# Altium schematic sheet Altimiter_SCH.SchDoc
size A; SheetNumber: 5; SheetTotal: 9
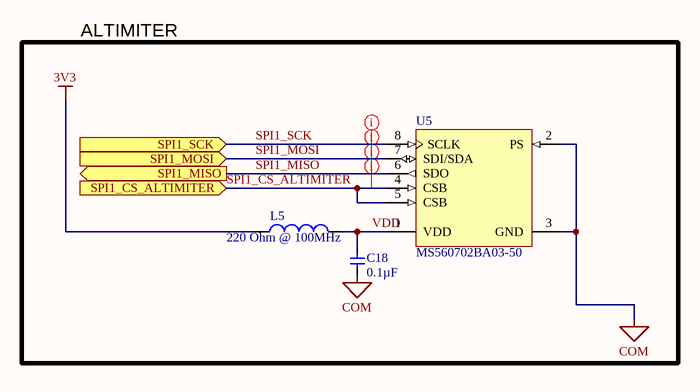
[diagram p0: Altimiter_SCH.SchDoc]

## Parts
C18  Capacitance: 0.1µF  [C0603]  (hidden comment: GRM188R71C104KA01D)
L5  Impedance @ Frequency: 220 Ohm @ 100MHz  [L0805]  (hidden comment: BLM21PG221SN1D)
U5  MS560702BA03-50  [TECO-MS560702BA03-50_V]

## Blocks framed on the sheet
ALTIMITER: C18 L5 U5

## Ports
SPI1_CS_ALTIMITER (in), SPI1_MISO (out), SPI1_MOSI (in), SPI1_SCK (in)

## Nets
3V3: L5.1
COM: C18.2 U5.2(PS) U5.3(GND)
SPI1_CS_ALTIMITER: U5.4(CSB) U5.5(CSB) ; port SPI1_CS_ALTIMITER
SPI1_MISO: U5.6(SDO) ; port SPI1_MISO
SPI1_MOSI: U5.7(SDI/SDA) ; port SPI1_MOSI
SPI1_SCK: U5.8(SCLK) ; port SPI1_SCK
VDD: C18.1 L5.2 U5.1(VDD)

## Layout directives
net class 50_Ohm: SPI1_CS_ALTIMITER, SPI1_MISO, SPI1_MOSI, SPI1_SCK

## Library data of the parts
C18 = GRM188R71C104KA01D: CAP CER 0.1UF 16V 10% X7R 0603; ComponentLink1Description: Datasheet; ComponentLink1URL: http://search.murata.co.jp/Ceramy/image/img/A01X/G101/ENG/GRM188R71C104KA01-01.pdf; ComponentLink2URL: http://media.digikey.com/photos/Murata%20Photos/0603%20Murata%20MLCC%20Caps.jpg; ComponentLink2Description: Photo; Pricing 1: 1=0.13 (USD); Tolerance: ±10%; Operating Temperature: -55°C ~ 125°C; Applications: General Purpose; Supplier 1: Digi-Key; Supplier Part Number 1: 490-1532-1-ND; Temperature Coefficient: X7R; Voltage - Rated: 16V
L5 = BLM21PG221SN1D: FERRITE CHIP 220 OHM 0805; Current Rating: 2A; DC Resistance (DCR): 45 mOhm Max; Filter Type: Differential Mode - Single; Supplier 1: Digi-Key; Supplier Part Number 1: 490-1054-1-ND; ComponentLink1URL: http://search.murata.co.jp/Ceramy/image/img/PDF/ENG/L0110S0100BLM21P.pdf; ComponentLink1Description: datasheet; ComponentLink2URL: http://media.digikey.com/photos/Murata%20Photos/BLM21%20SERIES%200805.jpg; ComponentLink2Description: photo
U5 = CMP-2000-07512-1: Barometric Pressure Sensor, with Stainless Steel Cap , 1.8 to 3.6 V, -40 to 85 degC, 8-Pin SMD, RoHS, Tape and Reel; Manufacturer: TE Connectivity; Lead Free: LeadFree; RoHSCompliant: false; Mounting Technology: SurfaceMount; Datasheet URL: http://www.te.com/commerce/DocumentDelivery/DDEController?Action=showdoc&DocId=Data+Sheet%7FMS5607-02BA03%7FB2%7Fpdf%7FEnglish%7FENG_DS_MS5607-02BA03_B2.pdf%7FMS560702BA03-50; Manufacturer URL: http://www.te.com/; Package Description: 8-Pin Surface Mount Device, Body 3 x 5 mm, Pitch 1.25 mm; Package Reference: MS560702BA03-50; Datasheet Version: 06/2017